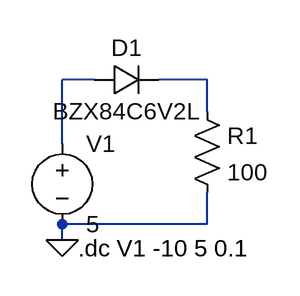
[diagram p0: schematic diode.asc]
diode.asc, the LTspice schematic file:
Version 4.1
SHEET 1 880 680
WIRE 176 64 144 64
WIRE 288 64 240 64
WIRE 288 96 288 64
WIRE 144 128 144 64
WIRE 288 208 288 176
WIRE 288 208 144 208
WIRE 144 224 144 208
FLAG 144 224 0
SYMBOL diode 176 80 R270
WINDOW 0 32 32 VTop 2
WINDOW 3 0 32 VBottom 2
SYMATTR InstName D1
SYMATTR Value BZX84C6V2L
SYMBOL voltage 144 112 R0
WINDOW 123 0 0 Left 0
WINDOW 39 0 0 Left 0
SYMATTR InstName V1
SYMATTR Value 5
SYMBOL res 272 80 R0
SYMATTR InstName R1
SYMATTR Value 100
TEXT 160 232 Left 2 !.dc V1 -10 5 0.1

The netlist it stands for:
* diode.asc
D1 N001 N002 BZX84C6V2L
V1 N001 0 5
R1 N002 0 100
.model D D
.lib standard.dio
.dc V1 -10 5 0.1
.backanno
.end

* Results of the author's LTspice run, read from the files saved beside the schematic
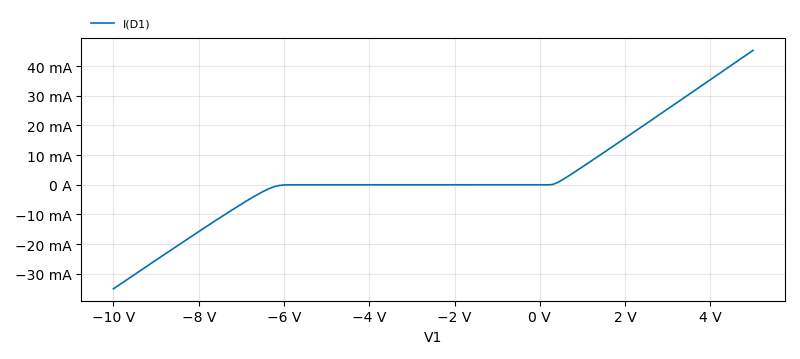
[diagram p1: DC transfer characteristic of diode.asc, plotted from the saved traces]
* DC transfer characteristic, 1 run:
*   I(D1): -35.06 mA at V1=-10 V, 45.32 mA at V1=5 V, min -35.06 mA, max 45.32 mA